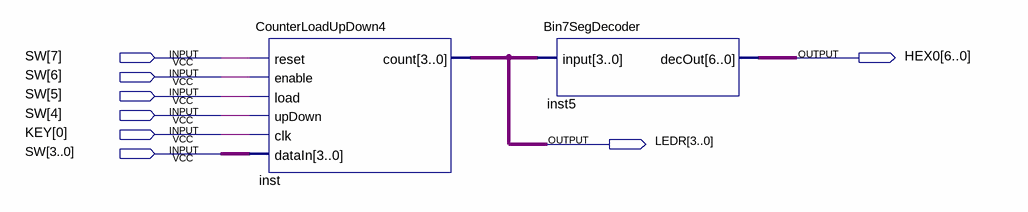
[diagram p0: schematic sheet]
// Quartus schematic Counter_Demo.bdf as structural Verilog: 2 symbols, 8 pins
module Counter_Demo (
  input  [7:0] SW,
  input  [0:0] KEY,
  output [6:0] HEX0,
  output [3:0] LEDR
);

  CounterLoadUpDown4 inst (
    .reset(SW[7]), .enable(SW[6]), .load(SW[5]), .upDown(SW[4]), .clk(KEY[0]), .dataIn(SW[3:0]), .count(LEDR));
  Bin7SegDecoder inst5 (.\input (LEDR), .decOut(HEX0));
endmodule
